# EAGLE design combined-board_external-wires (EAGLE 7.2.0)
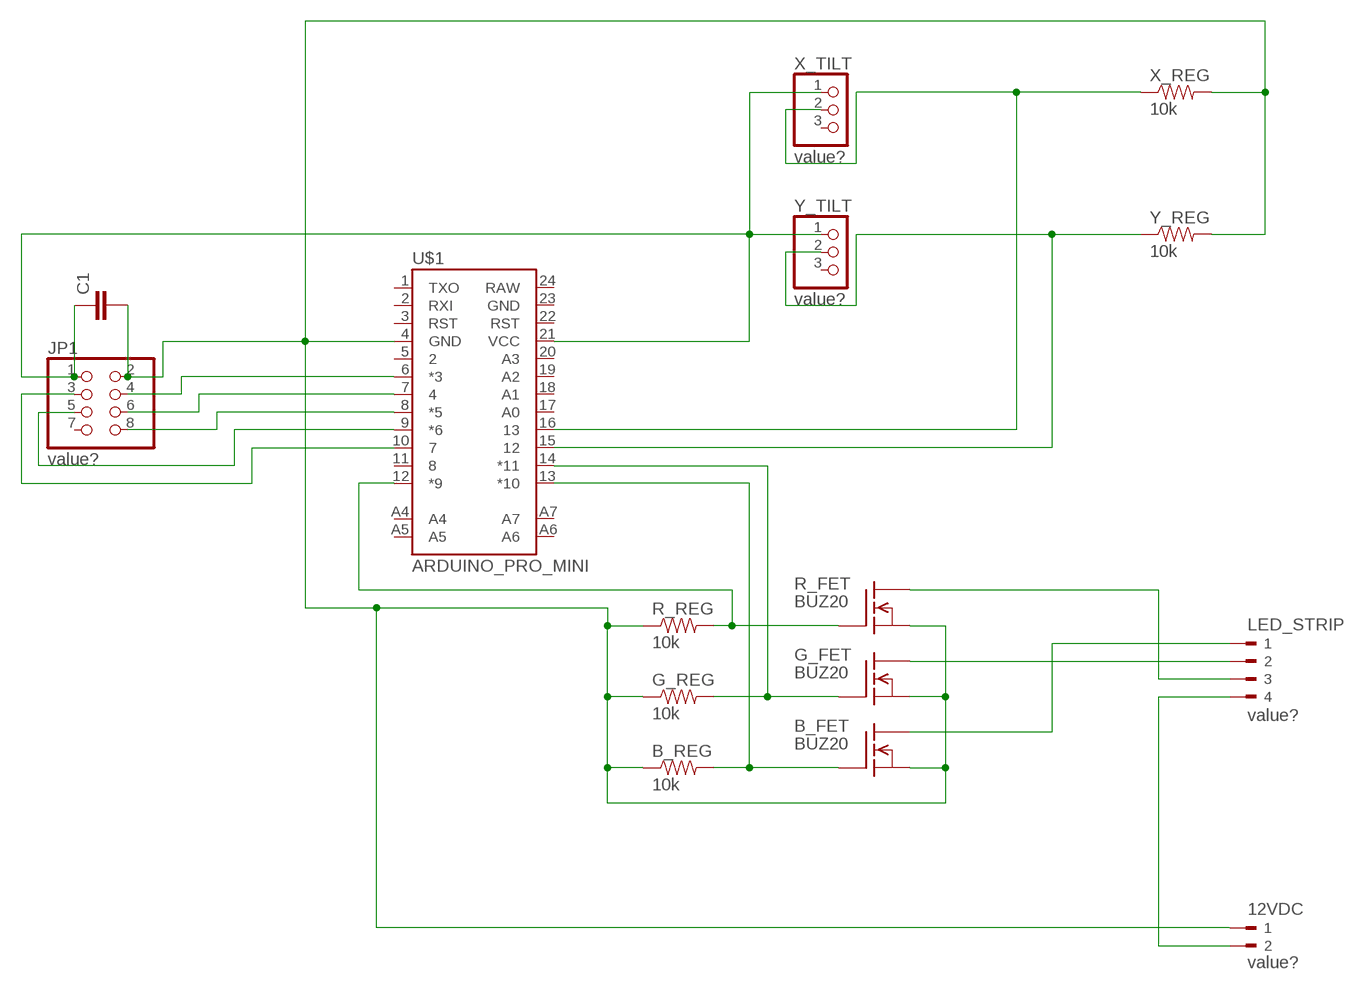
[diagram p0: schematic, sheet 1]

## Parts
12VDC  value?  180-2  [180-2]
B_FET  BUZ20  [TO220]
B_REG  10k  RESISTORPTH-1/4W  [AXIAL-0.4]
C1  CAPPTH  [CAP-PTH-SMALL]
G_FET  BUZ20  [TO220]
G_REG  10k  RESISTORPTH-1/4W  [AXIAL-0.4]
JP1  value?  PINHD-2X4  [2X04]
LED_STRIP  value?  180-4  [180-4]
R_FET  BUZ20  [TO220]
R_REG  10k  RESISTORPTH-1/4W  [AXIAL-0.4]
U$1  ARDUINO_PRO_MINI  [ARDUINO_PRO_MINI]
X_REG  10k  RESISTORPTH-1/4W  [AXIAL-0.4]
X_TILT  value?  PINHD-1X3  [1X03]
Y_REG  10k  RESISTORPTH-1/4W  [AXIAL-0.4]
Y_TILT  value?  PINHD-1X3  [1X03]

## Nets
N$1: U$1.16 X_REG.P$1 X_TILT.2
N$2: B_FET.1(G) B_REG.P$2 U$1.13(*10)
N$3: R_FET.1(G) R_REG.P$2 U$1.12(*9)
N$5: B_FET.2(D) LED_STRIP.1
N$6: U$1.15 Y_REG.P$1 Y_TILT.2
N$7: LED_STRIP.3 R_FET.2(D)
N$8: G_FET.2(D) LED_STRIP.2
N$9: 12VDC.2 LED_STRIP.4
N$10: 12VDC.1 B_FET.3(S) B_REG.P$1 C1.2 G_FET.3(S) G_REG.P$1 JP1.2 R_FET.3(S) R_REG.P$1 U$1.4(GND) X_REG.P$2 Y_REG.P$2
N$12: JP1.5 U$1.9(*6)
N$13: G_FET.1(G) G_REG.P$2 U$1.14(*11)
N$14: JP1.4 U$1.6(*3)
N$15: JP1.6 U$1.7
N$16: JP1.8 U$1.8(*5)
N$17: JP1.3 U$1.10
Y_TILT: C1.1 JP1.1 U$1.21(VCC) X_TILT.1 Y_TILT.1
Unconnected: JP1.7 U$1.1(TXO) U$1.2(RXI) U$1.3(RST) U$1.5 U$1.11 U$1.17(A0) U$1.18(A1) U$1.19(A2) U$1.20(A3) U$1.22(RST) U$1.23(GND) U$1.24(RAW) U$1.A4 U$1.A5 U$1.A6 U$1.A7 X_TILT.3 Y_TILT.3

## Library data of the parts
12VDC = con-weidmueller-sl35:180-2: WEIDMUELLER CLAMP CONNECTOR; OC_FARNELL: unknown; OC_NEWARK: unknown
B_FET G_FET R_FET = transistor-fet:BUZ20: N-Channel Enhancement MOSFET 100V; 12A; 0,2Ohm
B_REG G_REG R_REG X_REG Y_REG = SparkFun-Passives:RESISTOR: Resistor Basic schematic elements and footprints for 0603, 1206, and PTH resistors.
C1 = SparkFun-Passives:CAP: Capacitor Standard 0603 ceramic capacitor, and 0.1" leaded capacitor.
JP1 = pinhead:PINHD-2X4: PIN HEADER
LED_STRIP = con-weidmueller-sl35:180-4: WEIDMUELLER CLAMP CONNECTOR; OC_FARNELL: unknown; OC_NEWARK: unknown
U$1 = SparkFun-Boards:ARDUINO_PRO_MINI
X_TILT Y_TILT = pinhead:PINHD-1X3: PIN HEADER

## Board
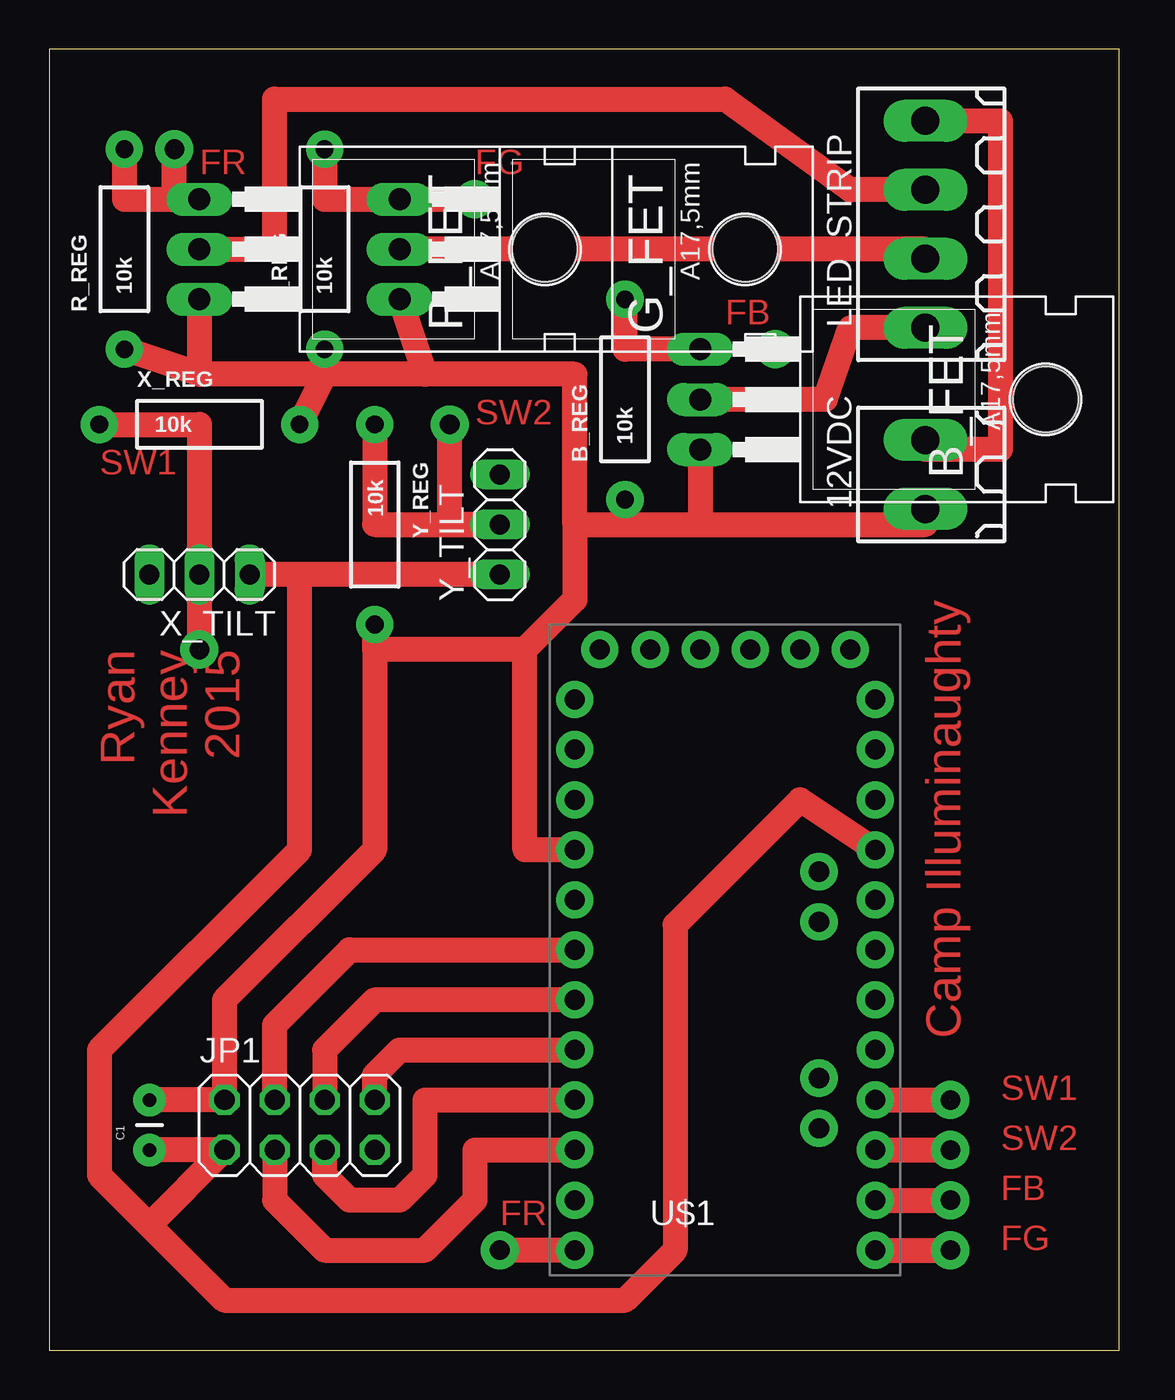
[diagram p1: board, top side]
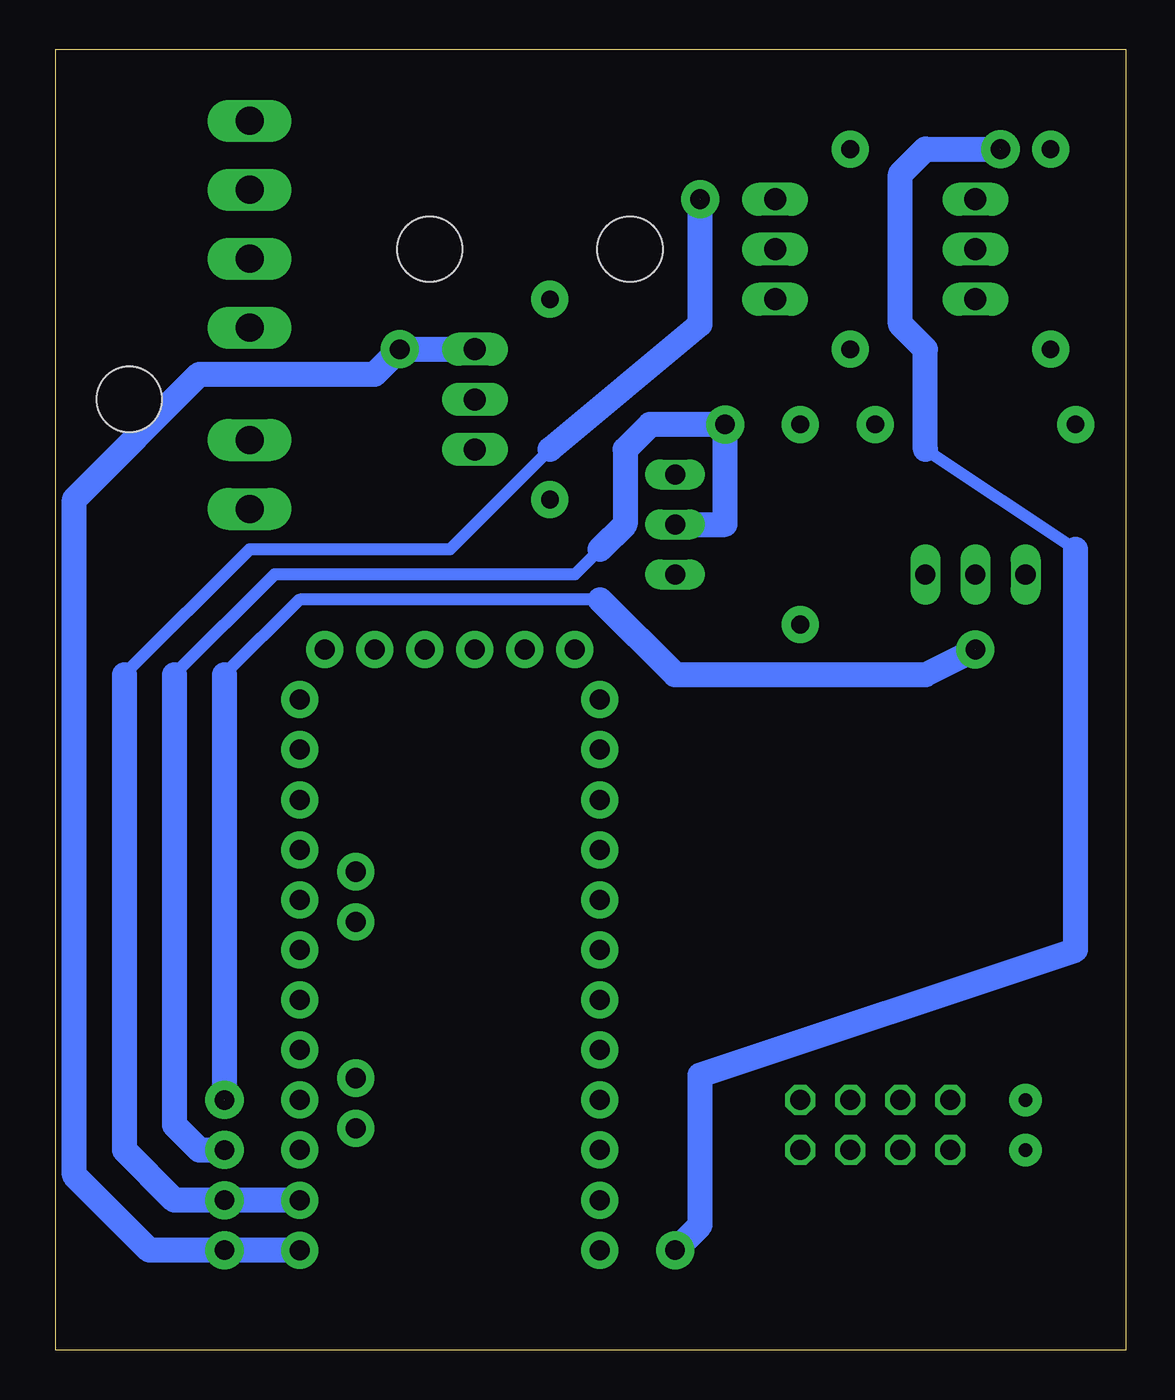
[diagram p2: board, bottom side, seen from below]

Size 54.28 x 66.03 mm. Coordinates in mm from the lower left corner, seen from the top.
Outline: 0,0 54.28,0 54.28,66.03 0,66.03 0,0
Copper layers (1*16): Top 0.035mm / dielectric 1.5mm / Bottom 0.035mm
Design rules "default": minimum track width 10mil, minimum drill 24mil, track to track 8mil, track to pad 8mil, pad to pad 8mil, via to via 8mil, smd to smd 8mil, copper to edge 40mil, drill to drill 8mil, minimum pad ring 10mil, minimum via ring 8mil, stop-mask expansion 4mil, vias tented up to drill 0mil, thermal gap 10mil

### Footprints (pad centres in the part's own frame; a part is rotated, then mirrored left to right if it is on the bottom)
180-2 = drill 1.422 long: 1 -1.75,0; 2 1.75,0
TO220 = drill 1.118 long: 1 -2.54,-6.35; 2 0,-6.35; 3 2.54,-6.35 | hole 3.302: 0,11.176
AXIAL-0.4 = drill 0.9 pad 1.88: P$1 -5.08,0; P$2 5.08,0
CAP-PTH-SMALL = drill 0.7 pad 1.651: 1 0,0; 2 2.54,0
2X04 = drill 1.016 octagon: 1 -3.81,-1.27; 2 -3.81,1.27; 3 -1.27,-1.27; 4 -1.27,1.27; 5 1.27,-1.27; 6 1.27,1.27; 7 3.81,-1.27; 8 3.81,1.27
180-4 = drill 1.422 long: 1 -5.25,0; 2 -1.75,0; 3 1.75,0; 4 5.25,0
ARDUINO_PRO_MINI = drill 1.016 pad 1.88: 1 -7.62,12.7; 2 -7.62,10.16; 3 -7.62,7.62; 4 -7.62,5.08; 5 -7.62,2.54; 6 -7.62,0; 7 -7.62,-2.54; 8 -7.62,-5.08; 9 -7.62,-7.62; 10 -7.62,-10.16; 11 -7.62,-12.7; 12 -7.62,-15.24; 13 7.62,-15.24; 14 7.62,-12.7; 15 7.62,-10.16; 16 7.62,-7.62; 17 7.62,-5.08; 18 7.62,-2.54; 19 7.62,0; 20 7.62,2.54; 21 7.62,5.08; 22 7.62,7.62; 23 7.62,10.16; 24 7.62,12.7; A4 4.763,1.429; A5 4.763,3.969; A6 4.763,-9.049; A7 4.763,-6.509; BLK -6.35,15.24; GND -3.81,15.24; GRN 6.35,15.24; RXI 1.27,15.24; TXO 3.81,15.24; VCC -1.27,15.24
1X03 = drill 1.016 long: 1 -2.54,0; 2 0,0; 3 2.54,0

### Placement (x,y rotation side)
12VDC  44.45,44.45 90 top
B_FET  39.37,48.26 270 top
B_REG  29.21,48.26 90 top
C1  5.08,10.16 90 top
G_FET  24.13,55.88 270 top
G_REG  13.97,55.88 90 top
JP1  12.7,11.43 0 top
LED_STRIP  44.45,57.15 90 top
R_FET  13.97,55.88 270 top
R_REG  3.81,55.88 90 top
U$1  34.29,20.32 0 top
X_REG  7.62,46.99 0 top
X_TILT  7.62,39.37 180 top
Y_REG  16.51,41.91 270 top
Y_TILT  22.86,41.91 90 top

### Tracks (layer width: path | path; a pad name or v marks a point on that pad's centre or on a via)
N$1  (2 unrouted)
  Top 1.27: U$1.16 45.72,12.7 | X_REG.P$1 7.62,46.99 X_TILT.2 7.62,35.56
  Bottom 0.61: 26.67,38.1 41.91,38.1 45.72,34.29
  Bottom 1.27: 26.67,38.1 22.86,34.29 10.16,34.29 7.62,35.56 | 45.72,34.29 45.72,12.7
N$2  (via drill 1 pad 1.93)
  Top 1.27: U$1.13 v45.72,5.08 | B_FET.1 29.21,50.8 B_REG.P$2
  Bottom 1.27: U$1.13 v45.72,5.08 49.53,5.08 53.34,8.89 53.34,43.18 46.99,49.53 38.1,49.53 36.83,50.8 B_FET.1
N$3  (via drill 1 pad 1.93)  (1 unrouted)
  Top 1.27: U$1.12 v22.86,5.08 | R_REG.P$2 3.81,58.42 6.35,58.42 | 6.35,58.42 R_FET.1 | 6.35,58.42 6.35,60.96
  Bottom 0.61: 2.54,40.64 10.16,45.72
  Bottom 1.27: v22.86,5.08 21.59,6.35 21.59,13.97 2.54,20.32 2.54,40.64 | 10.16,45.72 10.16,50.8 11.43,52.07 11.43,59.69 10.16,60.96 6.35,60.96
N$4  (via drill 1 pad 1.93)
  other vias: 45.72,12.7
N$5
  Top 1.27: LED_STRIP.1 40.64,51.9 39.37,48.26 B_FET.2
N$6  (via drill 1 pad 1.93)
  Top 1.27: U$1.15 v45.72,10.16 | Y_REG.P$1 16.51,41.91 Y_TILT.2 20.32,41.91 20.32,46.99
  Bottom 0.61: 26.67,40.64 27.94,39.37 43.18,39.37 48.26,34.29
  Bottom 1.27: Y_TILT.2 20.32,41.91 20.32,46.99 24.13,46.99 25.4,45.72 25.4,41.91 26.67,40.64 | 48.26,34.29 48.26,11.43 46.99,10.16 v45.72,10.16
N$7
  Top 1.27: LED_STRIP.3 40.64,58.9 34.29,63.5 11.43,63.5 11.43,55.88 R_FET.2
N$8
  Top 1.27: G_FET.2 44.45,55.88 LED_STRIP.2
N$9
  Top 1.27: LED_STRIP.4 48.26,62.4 48.26,45.72 44.45,45.72 12VDC.2
N$10
  Top 1.27: 26.67,41.91 26.67,49.53 19.05,49.53 | 19.05,49.53 13.97,49.53 | 13.97,49.53 X_REG.P$2 | G_REG.P$1 13.97,49.53 | G_FET.3 19.05,49.53 | 13.97,49.53 7.62,49.53 | 7.62,49.53 R_REG.P$1 | R_FET.3 7.62,49.53 | 16.51,35.56 Y_REG.P$2 | U$1.4 24.13,25.4 24.13,35.56 | 26.67,41.91 29.21,41.91 | 29.21,41.91 33.02,41.91 | 33.02,41.91 44.45,41.91 12VDC.1 | B_FET.3 33.02,41.91 | B_REG.P$1 29.21,41.91 | 26.67,41.91 26.67,38.1 24.13,35.56 | 24.13,35.56 16.51,35.56 | 16.51,35.56 16.51,25.4 8.89,17.78 JP1.2 C1.2
N$11  (via drill 1 pad 1.93)
  other vias: 7.62,35.56
N$12
  Top 1.27: U$1.9 19.05,12.7 19.05,8.89 17.78,7.62 15.24,7.62 13.97,8.89 JP1.5
N$13  (via drill 1 pad 1.93)  (1 unrouted)
  Top 1.27: U$1.14 v45.72,7.62 | G_REG.P$2 13.97,58.42 G_FET.1 21.59,58.42
  Bottom 0.61: 29.21,45.72 34.29,40.64 44.45,40.64 50.8,34.29
  Bottom 1.27: U$1.14 48.26,7.62 50.8,10.16 50.8,34.29 | 29.21,45.72 21.59,52.07 21.59,58.42
N$14
  Top 1.27: JP1.4 11.43,16.51 15.24,20.32 U$1.6
N$15
  Top 1.27: U$1.7 16.51,17.78 13.97,15.24 JP1.6
N$16
  Top 1.27: JP1.8 16.51,13.97 17.78,15.24 U$1.8
N$17
  Top 1.27: U$1.10 21.59,10.16 21.59,7.62 19.05,5.08 13.97,5.08 11.43,7.62 JP1.3
N$18  (via drill 1 pad 1.93)
  other vias: 20.32,46.99
N$19  (via drill 1 pad 1.93)
  other vias: 21.59,58.42
N$20  (via drill 1 pad 1.93)
  other vias: 36.83,50.8
N$22  (via drill 1 pad 1.93)
  other vias: 6.35,60.96
Y_TILT
  Top 1.27: U$1.21 38.1,27.94 31.75,21.59 31.75,5.08 29.21,2.54 8.89,2.54 5.08,6.35 | Y_TILT.1 12.7,39.37 | 12.7,39.37 X_TILT.1 | 12.7,39.37 12.7,25.4 2.54,15.24 2.54,8.89 5.08,6.35 | C1.1 JP1.1 5.08,6.35

### Text on the board
Top: FR | FG | FB | SW2 | SW1 | Camp Illuminaughty | Ryan / Kenney / 2015 | SW1 | SW2 | FB | FR | FG